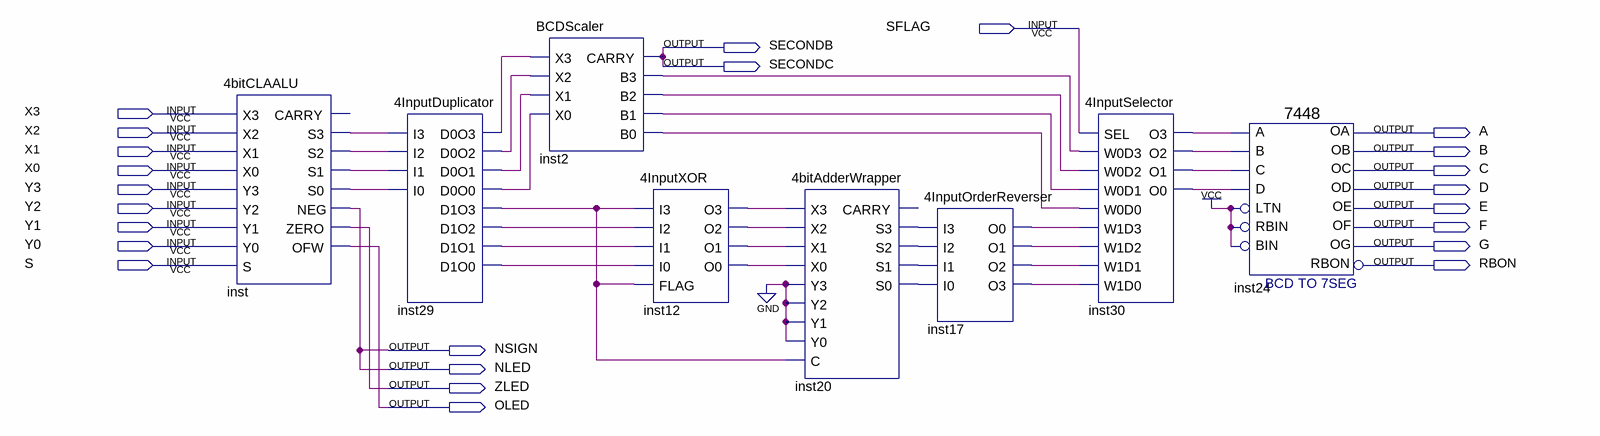
[diagram p0: schematic sheet]
// Quartus schematic ProjectCache.bdf as structural Verilog: 8 symbols, 24 pins
module ProjectCache (
  input  SFLAG,
  input  X3,
  input  X2,
  input  X1,
  input  X0,
  input  Y3,
  input  Y2,
  input  Y1,
  input  Y0,
  input  S,
  output SECONDB,
  output SECONDC,
  output A,
  output B,
  output C,
  output D,
  output E,
  output F,
  output G,
  output RBON,
  output NSIGN,
  output NLED,
  output ZLED,
  output OLED
);

  wire inst2_b0, inst2_b1, inst2_b2, inst2_b3, inst12_o0, inst12_o1, inst12_o2, inst12_o3, inst17_o0,
       inst17_o1, inst17_o2, inst17_o3, inst20_s0, inst20_s1, inst20_s2, inst20_s3, inst29_d0o0, inst29_d0o1,
       inst29_d0o2, inst29_d0o3, inst29_d1o0, inst29_d1o1, inst29_d1o2, inst29_d1o3, inst30_o0, inst30_o1,
       inst30_o2, inst30_o3, inst_s0, inst_s1, inst_s2, inst_s3;

  \4bitCLAALU  inst (
    .X3(X3), .X2(X2), .X1(X1), .X0(X0), .Y3(Y3), .Y2(Y2), .Y1(Y1), .Y0(Y0), .S(S), .S3(inst_s3),
    .S2(inst_s2), .S1(inst_s1), .S0(inst_s0), .NEG(NLED), .ZERO(ZLED), .OFW(OLED));  // open: CARRY
  \4InputDuplicator  inst29 (
    .I3(inst_s3), .I2(inst_s2), .I1(inst_s1), .I0(inst_s0), .D0O3(inst29_d0o3), .D0O2(inst29_d0o2),
    .D0O1(inst29_d0o1), .D0O0(inst29_d0o0), .D1O3(inst29_d1o3), .D1O2(inst29_d1o2), .D1O1(inst29_d1o1),
    .D1O0(inst29_d1o0));
  BCDScaler inst2 (
    .X3(inst29_d0o3), .X2(inst29_d0o2), .X1(inst29_d0o1), .X0(inst29_d0o0), .CARRY(SECONDB), .B3(inst2_b3),
    .B2(inst2_b2), .B1(inst2_b1), .B0(inst2_b0));
  \4InputXOR  inst12 (
    .I3(inst29_d1o3), .I2(inst29_d1o2), .I1(inst29_d1o1), .I0(inst29_d1o0), .FLAG(inst29_d1o3),
    .O3(inst12_o3), .O2(inst12_o2), .O1(inst12_o1), .O0(inst12_o0));
  \4bitAdderWrapper  inst20 (
    .X3(inst12_o3), .X2(inst12_o2), .X1(inst12_o1), .X0(inst12_o0), .Y3(1'b0), .Y2(1'b0), .Y1(1'b0),
    .Y0(1'b0), .C(inst29_d1o3), .S3(inst20_s3), .S2(inst20_s2), .S1(inst20_s1), .S0(inst20_s0));  // open: CARRY
  \4InputOrderReverser  inst17 (
    .I3(inst20_s3), .I2(inst20_s2), .I1(inst20_s1), .I0(inst20_s0), .O0(inst17_o0), .O1(inst17_o1),
    .O2(inst17_o2), .O3(inst17_o3));
  \4InputSelector  inst30 (
    .SEL(SFLAG), .W0D3(inst2_b3), .W0D2(inst2_b2), .W0D1(inst2_b1), .W0D0(inst2_b0), .W1D3(inst17_o0),
    .W1D2(inst17_o1), .W1D1(inst17_o2), .W1D0(inst17_o3), .O3(inst30_o3), .O2(inst30_o2), .O1(inst30_o1),
    .O0(inst30_o0));
  \7448  inst24 (
    .A(inst30_o3), .C(inst30_o1), .D(inst30_o0), .B(inst30_o2), .RBIN(1'b1), .BIN(1'b1), .LTN(1'b1), .OC(C),
    .OE(E), .OD(D), .OF(F), .OG(G), .OB(B), .OA(A), .RBON(RBON));

  assign NSIGN = NLED;
  assign SECONDC = SECONDB;
endmodule
